# EAGLE design klbr4breakout-1 (EAGLE 9.4.0)
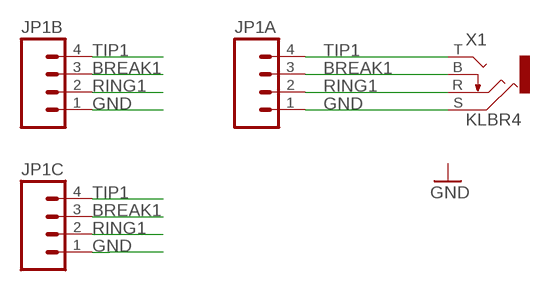
[diagram p0: schematic, sheet 1]

## Parts
JP1A  M04PTH  [1X04]
JP1B  M04PTH  [1X04]
JP1C  M04PTH  [1X04]
X1  KLBR4  [KLBR4]

## Nets
BREAK1: JP1A.3 JP1B.3 JP1C.3 X1.B
GND: JP1A.1 JP1B.1 JP1C.1 X1.S
RING1: JP1A.2 JP1B.2 JP1C.2 X1.R
TIP1: JP1A.4 JP1B.4 JP1C.4 X1.T

## Library data of the parts
JP1A JP1B JP1C = SparkFun-Connectors:M04: Header 4 Standard 4-pin 0.1" header. Use with straight break away headers (SKU : PRT-00116), right angle break away headers (PRT-00553), swiss pins (PRT-00743), machine pins (PRT-00117), and female headers (PRT-00115). Molex polarized connector foot print use with SKU : PRT-08231 with associated crimp pins and housings. 1MM SMD Version SKU: PRT-10208
X1 = ubiyubix:KLBR4

## Net classes
0 default: width 0.61 mm

## Board
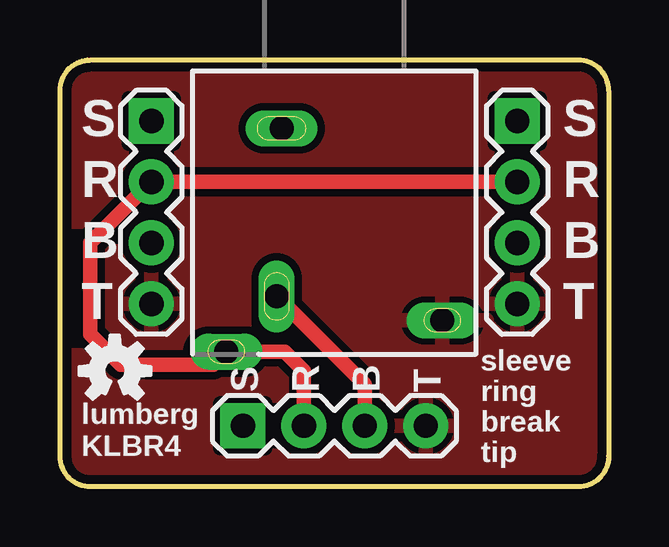
[diagram p1: board, top side]
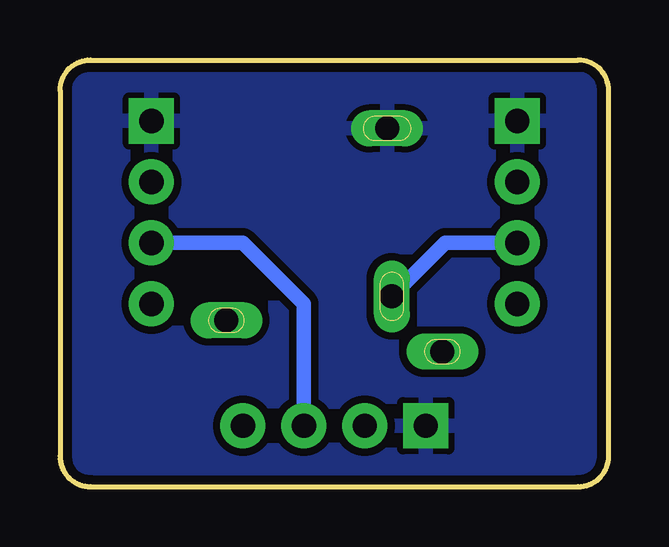
[diagram p2: board, bottom side, seen from below]

Size 22.86 x 17.78 mm. Coordinates in mm from the lower left corner, seen from the top.
Outline: 21.59,17.78 1.27,17.78 arc90 0,16.51 0,1.27 arc90 1.27,0 21.59,0 arc90 22.86,1.27 22.86,16.51 arc90 21.59,17.78
Copper layers (1*16): Top 0.0356mm / dielectric 1.5011mm / Bottom 0.0356mm
Design rules "LaenPCBOrder_Conservative": minimum track width 13mil, minimum drill 13mil, track to track 12mil, track to pad 12mil, pad to pad 12mil, via to via 12mil, smd to smd 12mil, copper to edge 15mil, drill to drill 12mil, minimum pad ring 7mil, minimum via ring 7mil, stop-mask expansion 4mil, vias tented up to drill 0mil, thermal gap 10mil

### Footprints (pad centres in the part's own frame; a part is rotated, then mirrored left to right if it is on the bottom)
1X04 = drill 1.016 pad 1.88 square: 1 0,0 | drill 1.016 pad 1.88: 2 2.54,0; 3 5.08,0; 4 7.62,0
KLBR4 = drill 1 pad 1.3 long: B -2.4,-3.5; S -2.2,3.5 | drill 1 pad 1.2 long: R -4.5,-5.8; T 4.5,-4.5

### Placement (x,y rotation side)
JP1A  3.81,15.24 270 top
JP1B  7.62,2.54 0 top
JP1C  19.05,15.24 270 top
U$1  [OSHW-LOGO-S]  2.29,4.83 0 top
X1  11.43,11.43 0 top

### Tracks (layer width: path | path; a pad name or v marks a point on that pad's centre or on a via)
BREAK1
  Top 0.61: X1.B 12.7,4.26 JP1B.3
  Bottom 0.61: JP1B.3 12.7,7.62 15.24,10.16 JP1C.3 | JP1A.3 6.8,10.16 X1.B
GND
  pour Bottom: 0,17.78 22.86,17.78 22.86,0 0,0
RING1
  Top 0.61: JP1C.2 JP1A.2 1.27,10.16 1.27,6.35 2.54,5.08 6.38,5.08 X1.R 9.36,5.63 10.16,4.83 JP1B.2
TIP1
  pour Top: 0,17.78 22.86,17.78 22.86,0 0,0

### Text on the board
tPlace: S | S | R | R | B | B | T | T | sleeve | S | R | B | T | ring | break | lumberg / KLBR4 | tip